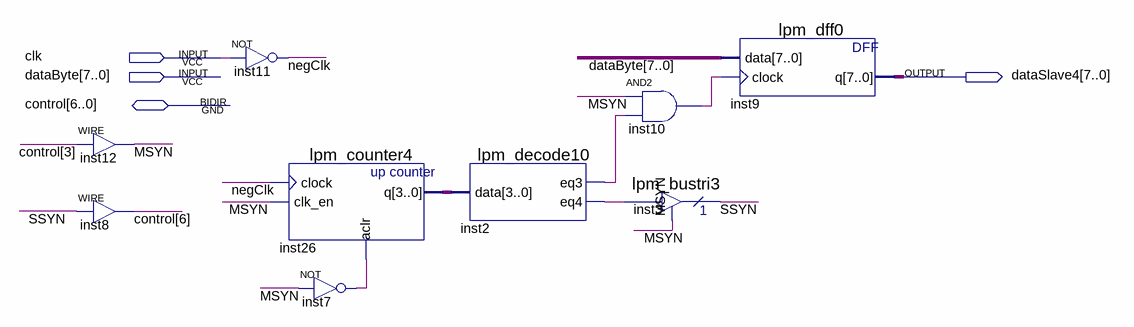
[diagram p0: schematic sheet]
// Quartus schematic Slave4.bdf as structural Verilog: 9 symbols, 4 pins
module Slave4 (
  input  clk,
  input  [7:0] dataByte,
  inout  [6:0] control,
  output [7:0] dataSlave4
);

  wire inst2_eq3, inst2_eq4, inst7_out, inst10_out, MSYN, negClk, SSYN;
  wire [3:0] inst26_q;

  assign MSYN = control[3];  // WIRE inst12
  assign control[6] = SSYN;  // WIRE inst8
  not inst11 (negClk, clk);
  lpm_counter4 inst26 (.clock(negClk), .clk_en(MSYN), .aclr(inst7_out), .q(inst26_q));
  not inst7 (inst7_out, MSYN);
  lpm_decode10 inst2 (.data(inst26_q), .eq3(inst2_eq3), .eq4(inst2_eq4));
  and inst10 (inst10_out, MSYN, inst2_eq3);
  lpm_bustri3 inst3 (.enabledt(MSYN), .data(inst2_eq4), .tridata(SSYN));
  lpm_dff0 inst9 (.data(dataByte), .clock(inst10_out), .q(dataSlave4));
endmodule
